# Altium schematic sheet MAIN.SchDoc
size A; SheetNumber: 1; SheetTotal: 10
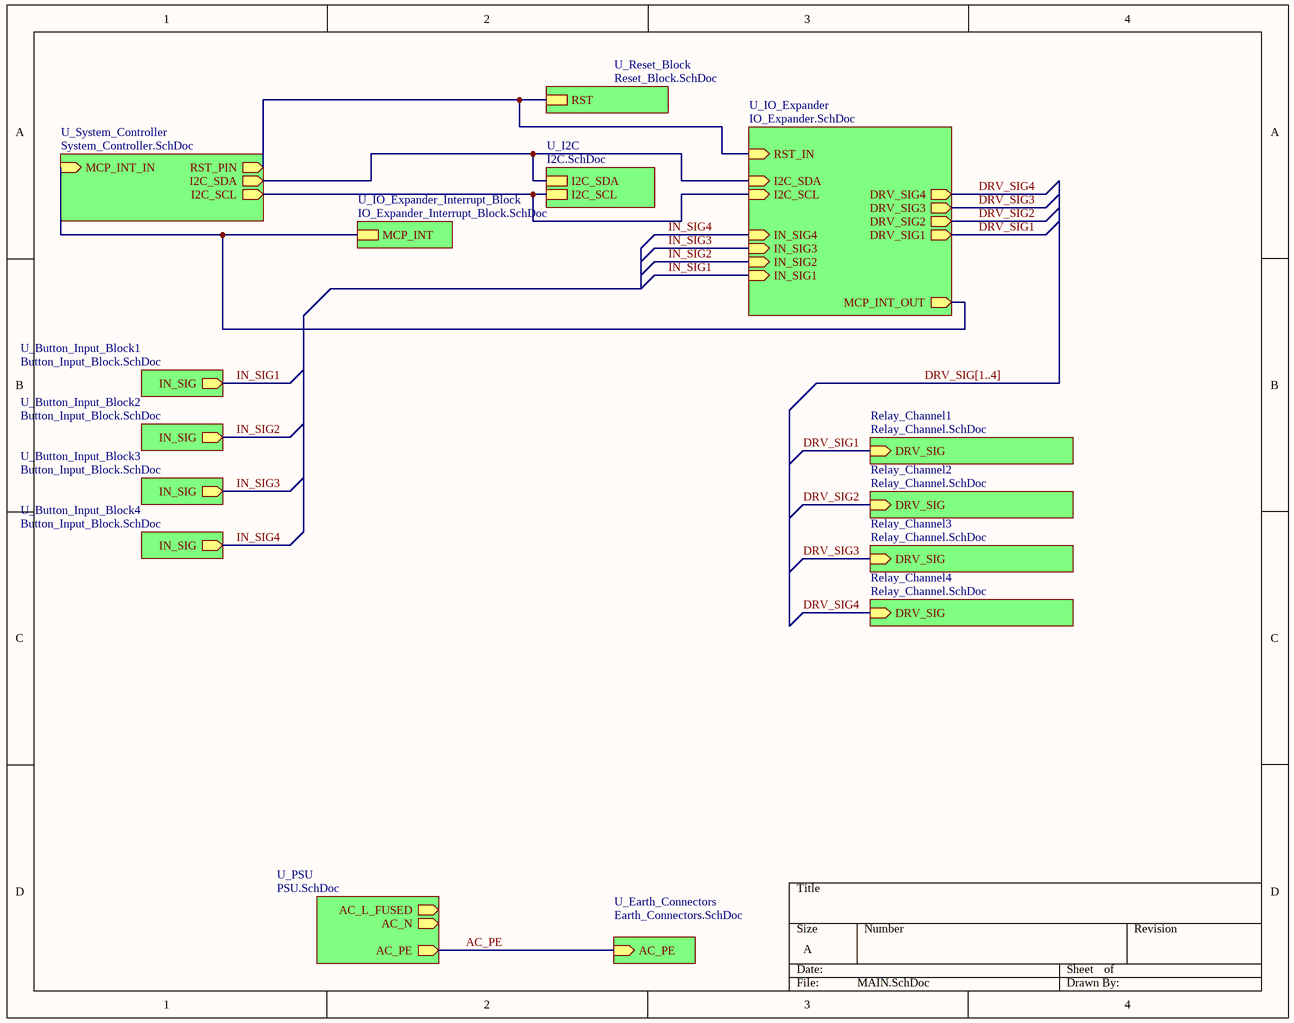
[diagram p0: MAIN.SchDoc]

## Sub-sheets
Relay_Channel1 = Relay_Channel.SchDoc: DRV_SIG (in)
Relay_Channel2 = Relay_Channel.SchDoc: DRV_SIG (in)
Relay_Channel3 = Relay_Channel.SchDoc: DRV_SIG (in)
Relay_Channel4 = Relay_Channel.SchDoc: DRV_SIG (in)
U_Button_Input_Block1 = Button_Input_Block.SchDoc: IN_SIG (out)
U_Button_Input_Block2 = Button_Input_Block.SchDoc: IN_SIG (out)
U_Button_Input_Block3 = Button_Input_Block.SchDoc: IN_SIG (out)
U_Button_Input_Block4 = Button_Input_Block.SchDoc: IN_SIG (out)
U_Earth_Connectors = Earth_Connectors.SchDoc: AC_PE (in)
U_I2C = I2C.SchDoc: I2C_SCL, I2C_SDA
U_IO_Expander = IO_Expander.SchDoc: I2C_SDA (in), I2C_SCL (in), RST_IN (in), IN_SIG4 (in), IN_SIG3 (in), IN_SIG1 (in), IN_SIG2 (in), DRV_SIG4 (out), DRV_SIG1 (out), DRV_SIG3 (out), DRV_SIG2 (out), MCP_INT_OUT (out)
U_IO_Expander_Interrupt_Block = IO_Expander_Interrupt_Block.SchDoc: MCP_INT
U_PSU = PSU.SchDoc: AC_N (out), AC_L_FUSED (out), AC_PE (out)
U_Reset_Block = Reset_Block.SchDoc: RST
U_System_Controller = System_Controller.SchDoc: RST_PIN (out), MCP_INT_IN (in), I2C_SDA (out), I2C_SCL (out)

## Nets
AC_PE: sheet U_PSU/AC_PE, sheet U_Earth_Connectors/AC_PE
DRV_SIG1: sheet Relay_Channel1/DRV_SIG, sheet U_IO_Expander/DRV_SIG1
DRV_SIG2: sheet U_IO_Expander/DRV_SIG2, sheet Relay_Channel2/DRV_SIG
DRV_SIG3: sheet U_IO_Expander/DRV_SIG3, sheet Relay_Channel3/DRV_SIG
DRV_SIG4: sheet U_IO_Expander/DRV_SIG4, sheet Relay_Channel4/DRV_SIG
IN_SIG1: sheet U_IO_Expander/IN_SIG1, sheet U_Button_Input_Block1/IN_SIG
IN_SIG2: sheet U_IO_Expander/IN_SIG2, sheet U_Button_Input_Block2/IN_SIG
IN_SIG3: sheet U_IO_Expander/IN_SIG3, sheet U_Button_Input_Block3/IN_SIG
IN_SIG4: sheet U_IO_Expander/IN_SIG4, sheet U_Button_Input_Block4/IN_SIG
(unnamed): sheet U_IO_Expander/I2C_SDA, sheet U_I2C/I2C_SDA, sheet U_System_Controller/I2C_SDA
(unnamed): sheet U_IO_Expander/I2C_SCL, sheet U_I2C/I2C_SCL, sheet U_System_Controller/I2C_SCL
(unnamed): sheet U_IO_Expander/RST_IN, sheet U_Reset_Block/RST, sheet U_System_Controller/RST_PIN
(unnamed): sheet U_IO_Expander/MCP_INT_OUT, sheet U_IO_Expander_Interrupt_Block/MCP_INT, sheet U_System_Controller/MCP_INT_IN

## Buses and harness runs
bus DRV_SIG[1..4]